# EAGLE design atmega32u4-tqfp44-breakout (EAGLE 6.4)
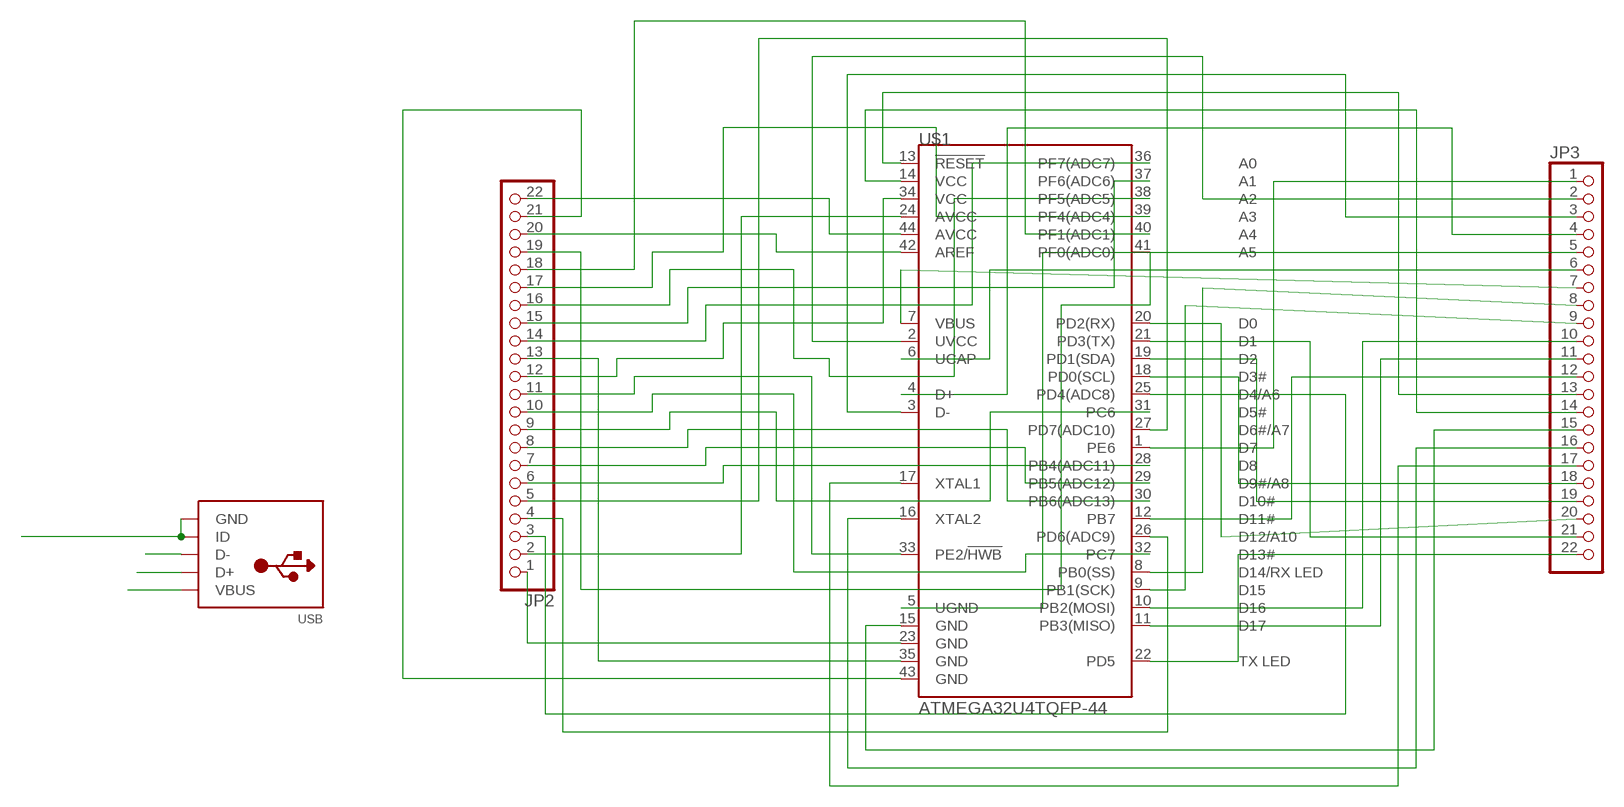
[diagram p0: schematic, sheet 1]

## Parts
JP2  PINHD-1X22  [1X22]
JP3  PINHD-1X22  [1X22]
U$1  ATMEGA32U4TQFP-44  [TQFP44]
USB  USBMOLEX  [USB-MINIB-THM-MOLEX]

## Nets
D+: JP3.4 U$1.4(D+)
D-: JP3.3 U$1.3(D-)
GND1 [power]: USB.GND USB.ID
N$1: JP3.1 U$1.1(PE6)
N$2: JP2.2 U$1.24(AVCC)
N$4: JP3.5 U$1.5(UGND)
N$5: JP3.6 U$1.6(UCAP)
N$6: JP3.7 U$1.7(VBUS)
N$7: JP3.8 U$1.8(PB0(SS))
N$8: JP3.9 U$1.9(PB1(SCK))
N$9: JP3.10 U$1.10(PB2(MOSI))
N$10: JP3.11 U$1.11(PB3(MISO))
N$11: JP3.12 U$1.12(PB7)
N$12: JP3.13 U$1.13(!RESET)
N$13: JP3.14 U$1.14(VCC)
N$14: JP3.15 U$1.15(GND)
N$15: JP3.16 U$1.16(XTAL2)
N$16: JP3.17 U$1.17(XTAL1)
N$17: JP3.18 U$1.18(PD0(SCL))
N$18: JP3.19 U$1.19(PD1(SDA))
N$19: JP3.20 U$1.20(PD2(RX))
N$20: JP3.21 U$1.21(PD3(TX))
N$21: JP3.22 U$1.22(PD5) USB.D-
N$23: JP2.1 U$1.23(GND) USB.D+
N$24: JP2.22 U$1.44(AVCC)
N$25: JP2.3 U$1.25(PD4(ADC8))
N$26: JP3.2 U$1.2(UVCC)
N$27: JP2.4 U$1.26(PD6(ADC9))
N$28: JP2.5 U$1.27(PD7(ADC10))
N$29: JP2.6 U$1.28(PB4(ADC11))
N$30: JP2.7 U$1.29(PB5(ADC12))
N$31: JP2.8 U$1.30(PB6(ADC13))
N$32: JP2.9 U$1.31(PC6)
N$33: JP2.10 U$1.32(PC7)
N$34: JP2.11 U$1.33(PE2/!HWB)
N$35: JP2.12 U$1.34(VCC)
N$36: JP2.13 U$1.35(GND)
N$37: JP2.14 U$1.36(PF7(ADC7))
N$38: JP2.15 U$1.37(PF6(ADC6))
N$39: JP2.16 U$1.38(PF5(ADC5))
N$40: JP2.17 U$1.39(PF4(ADC4))
N$41: JP2.18 U$1.40(PF1(ADC1))
N$42: JP2.19 U$1.41(PF0(ADC0))
N$43: JP2.20 U$1.42(AREF)
N$44: JP2.21 U$1.43(GND)
VCC [power]: USB.VBUS

## Library data of the parts
JP2 JP3 = pinhead:PINHD-1X22: PIN HEADER
U$1 = SparkFun-DigitalIC:ATMEGA32U4: Atmel 44-pin 8-bit Microcontroller with 32KBytes of ISP Flash and USB Controller
USB = adafruit:USB: USB Connectors USBMINIB - Surface Mount Female Mini-B USB Connector 4UConnector: 06564 By microbuilder.eu Thru-hole RA Female Mini-B USB Connector 4UConnector: 18732 By ladyada.net

## Net classes
0 default: width 0.178 mm, clearance 0.205 mm
1 power: width 0.61 mm, clearance 0.203 mm

## Board
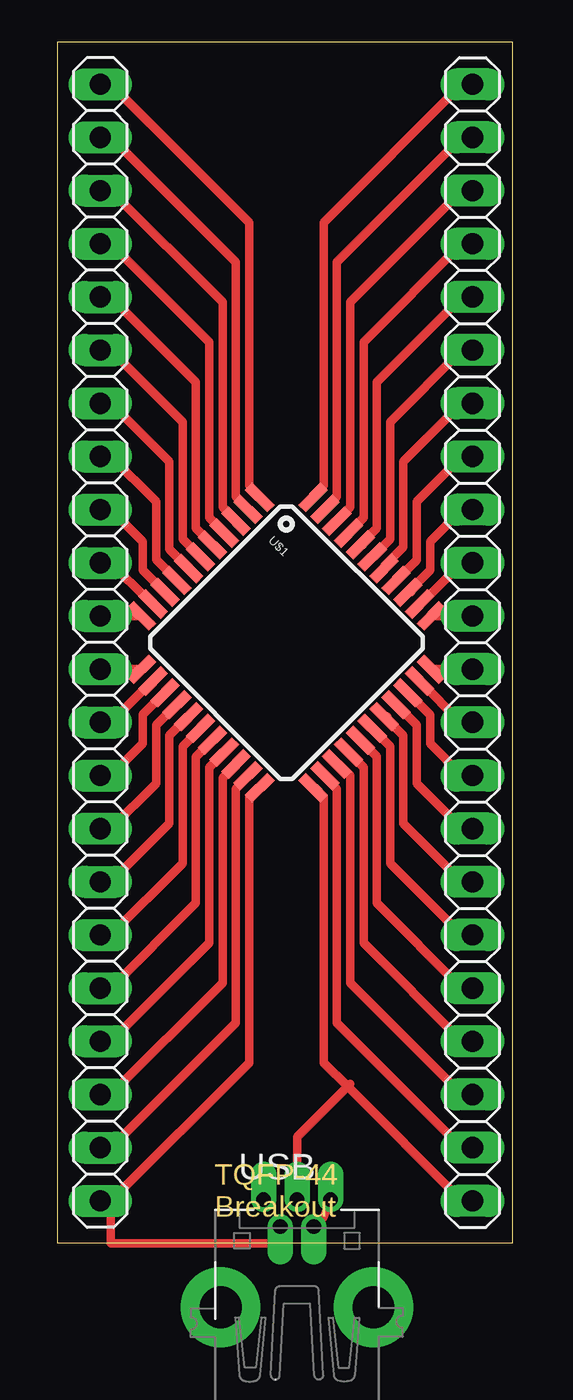
[diagram p1: board, top side]

No outline drawn. Coordinates in mm, seen from the top.
Copper layers (1*16): Top 0.035mm / dielectric 1.5mm / Bottom 0.035mm
Design rules "default *": minimum track width 10mil, minimum drill 24mil, track to track 8mil, track to pad 12mil, pad to pad 8mil, via to via 8mil, smd to smd 8mil, copper to edge 40mil, drill to drill 8mil, minimum pad ring 10mil, minimum via ring 8mil, stop-mask expansion 4mil, vias tented up to drill 0mil, thermal gap 10mil
Milling: 4 lines

### Footprints (pad centres in the part's own frame; a part is rotated, then mirrored left to right if it is on the bottom)
1X22 = drill 1.016 long: 1 -26.67,0; 2 -24.13,0; 3 -21.59,0; 4 -19.05,0; 5 -16.51,0; 6 -13.97,0; 7 -11.43,0; 8 -8.89,0; 9 -6.35,0; 10 -3.81,0; 11 -1.27,0; 12 1.27,0; 13 3.81,0; 14 6.35,0; 15 8.89,0; 16 11.43,0; 17 13.97,0; 18 16.51,0; 19 19.05,0; 20 21.59,0; 21 24.13,0; 22 26.67,0
TQFP44 = smd 1.5 x 0.5: 1 -5.8,4; 2 -5.8,3.2; 3 -5.8,2.4; 4 -5.8,1.6; 5 -5.8,0.8; 6 -5.8,0; 7 -5.8,-0.8; 8 -5.8,-1.6; 9 -5.8,-2.4; 10 -5.8,-3.2; 11 -5.8,-4; 23 5.8,-4; 24 5.8,-3.2; 25 5.8,-2.4; 26 5.8,-1.6; 27 5.8,-0.8; 28 5.8,0; 29 5.8,0.8; 30 5.8,1.6; 31 5.8,2.4; 32 5.8,3.2; 33 5.8,4 | smd 0.5 x 1.5: 12 -4,-5.8; 13 -3.2,-5.8; 14 -2.4,-5.8; 15 -1.6,-5.8; 16 -0.8,-5.8; 17 0,-5.8; 18 0.8,-5.8; 19 1.6,-5.8; 20 2.4,-5.8; 21 3.2,-5.8; 22 4,-5.8; 34 4,5.8; 35 3.2,5.8; 36 2.4,5.8; 37 1.6,5.8; 38 0.8,5.8; 39 0,5.8; 40 -0.8,5.8; 41 -1.6,5.8; 42 -2.4,5.8; 43 -3.2,5.8; 44 -4,5.8
USB-MINIB-THM-MOLEX = drill 0.7 offset: D+ 0,9.72; D- -0.8,8.42; GND 1.6,9.72; ID 0.8,8.42; VBUS -1.6,9.72 | drill 2 pad 3.81: GND1 -3.65,4.57; GND4 3.65,4.57

### Placement (x,y rotation side)
JP2  19.81,28.7 90 top
JP3  2.03,28.7 270 top
U$1  10.92,28.7 315 top
USB  11.43,-7.62 0 top

### Tracks (layer width: path | path; a pad name or v marks a point on that pad's centre or on a via)
D+
  Top 0.4: U$1.4 7.95,33.96 7.24,34.67 7.24,43.05 2.54,47.75 JP3.4
D-
  Top 0.4: U$1.3 8.52,34.53 7.87,35.18 7.87,44.96 2.54,50.29 JP3.3
GND1
  Top 0.4: USB.ID 12.7,1.27 USB.GND
N$1
  Top 0.4: U$1.1 9.65,35.69 9.14,36.2 9.14,48.77 2.54,55.37 JP3.1
N$2
  Top 0.4: U$1.24 12.76,22.29 13.34,21.72 13.34,10.54 19.3,4.57 JP2.2
N$4
  Top 0.4: U$1.5 7.39,33.38 6.6,34.16 6.6,41.15 2.54,45.21 JP3.5
N$5
  Top 0.4: U$1.6 | U$1.6 5.97,33.66 5.97,39.24 2.54,42.67 JP3.6
N$6
  Top 0.4: JP3.7 2.54,40.13 5.33,37.34 5.33,33.16 U$1.7
N$7
  Top 0.4: JP3.8 2.54,37.59 4.7,35.43 4.7,32.66 U$1.8
N$8
  Top 0.4: JP3.9 2.54,35.05 4.06,33.53 4.06,32.17 U$1.9
N$9
  Top 0.4: JP3.10 2.54,32.51 4.32,30.73 U$1.10
N$10
  Top 0.4: JP3.11 3.81,29.97 U$1.11
N$11
  Top 0.4: JP3.12 3.81,27.43 U$1.12
N$12
  Top 0.4: JP3.13 2.54,24.89 4.32,26.67 U$1.13
N$13
  Top 0.4: U$1.14 5.09,26.3 4.06,25.27 4.06,23.88 2.54,22.35 JP3.14
N$14
  Top 0.4: U$1.15 5.67,25.73 4.7,24.77 4.7,21.97 2.54,19.81 JP3.15
N$15
  Top 0.4: U$1.16 6.24,25.17 5.33,24.26 5.33,20.07 2.54,17.27 JP3.16
N$16
  Top 0.4: U$1.17 5.97,23.75 5.97,18.16 2.54,14.73 JP3.17
N$17
  Top 0.4: U$1.18 7.39,24.02 6.6,23.24 6.6,16.26 2.54,12.19 JP3.18
N$18
  Top 0.4: U$1.19 7.95,23.45 7.24,22.73 7.24,14.35 2.54,9.65 JP3.19
N$19
  Top 0.4: U$1.20 8.52,22.87 7.87,22.23 7.87,12.45 2.54,7.11 JP3.20
N$20
  Top 0.4: U$1.21 9.08,22.29 8.51,21.72 8.51,10.54 2.54,4.57 JP3.21
N$21
  Top 0.4: U$1.22 9.58,21.77 9.14,21.34 9.14,8.64 2.54,2.03 JP3.22 2.54,2.54 2.54,0 10.16,0 USB.D-
N$23
  Top 0.254: 13.97,7.62 13.84,7.49
  Top 0.4: U$1.23 12.26,21.77 12.7,21.34 12.7,8.64 13.84,7.49 | 13.84,7.49 19.3,2.03 JP2.1 | 13.84,7.49 11.43,5.08 11.43,2.54 USB.D+ | 13.97,7.62 13.84,7.49
N$24
  Top 0.4: U$1.44 12.2,35.69 12.7,36.2 12.7,48.77 19.3,55.37 JP2.22
N$25
  Top 0.4: U$1.25 13.42,22.9 13.97,22.35 13.97,12.45 19.3,7.11 JP2.3
N$26
  Top 0.4: U$1.2 9.08,35.11 8.51,35.69 8.51,46.86 2.54,52.83 JP3.2
N$27
  Top 0.4: U$1.26 13.89,23.45 14.61,22.73 14.61,14.35 19.3,9.65 JP2.4
N$28
  Top 0.4: U$1.27 15.24,23.25 15.24,16.26 19.3,12.19 JP2.5
N$29
  Top 0.4: U$1.28 | U$1.28 15.88,23.75 15.88,18.16 19.3,14.73 JP2.6
N$30
  Top 0.4: U$1.29 15.73,25.17 15.73,25.04 16.51,24.26 16.51,20.07 19.3,17.27 JP2.7
N$31
  Top 0.4: U$1.30 16.18,25.73 17.14,24.77 17.14,21.97 19.3,19.81 JP2.8
N$32
  Top 0.4: U$1.31 17.78,25.24 17.78,23.88 19.3,22.35 JP2.9
N$33
  Top 0.4: U$1.32 19.26,24.89 JP2.10
N$34  (1 unrouted)
  Top 0.4: U$1.33 18.54,27.43 | 18.54,27.43 JP2.11
N$35
  Top 0.4: U$1.34 JP2.12
N$36
  Top 0.4: U$1.35 17.33,30.54 19.3,32.51 JP2.13
N$37
  Top 0.4: 16.88,31.11 U$1.36 17.78,32.17 17.78,33.53 19.3,35.05 JP2.14
N$38
  Top 0.4: U$1.37 16.18,31.67 17.14,32.64 17.14,35.43 19.3,37.59 JP2.15
N$39
  Top 0.4: U$1.38 15.6,32.24 15.6,32.37 16.51,33.27 16.51,37.34 19.3,40.13 JP2.16
N$40
  Top 0.4: U$1.39 15.15,32.8 15.15,32.93 15.88,33.66 15.88,39.24 19.3,42.67 JP2.17
N$41
  Top 0.4: U$1.40 14.57,33.37 14.57,33.5 15.24,34.16 15.24,41.15 19.3,45.21 JP2.18
N$42
  Top 0.4: U$1.41 13.89,33.96 14.61,34.67 14.61,43.05 19.3,47.75 JP2.19
N$43
  Top 0.4: U$1.42 13.33,34.53 13.97,35.18 13.97,44.96 19.3,50.29 JP2.20
N$44
  Top 0.4: U$1.43 12.84,35.07 12.84,35.19 13.34,35.69 13.34,46.86 19.3,52.83 JP2.21

### Text on the board
Milling: TQFP-44 / Breakout